# Altium project BY-IOM-v0.2.PrjPCB
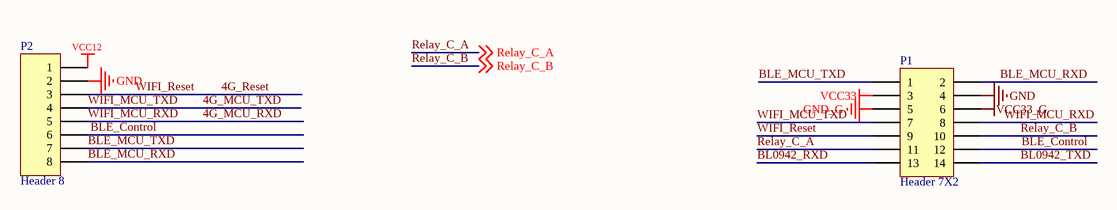
[diagram p0: 连接.SchDoc]
3 sheets, 35 parts. Net scope: global (net labels, ports and power ports of the same name join across sheets).
Board file: Power.PcbDoc
Sheets:
  连接.SchDoc
  继电器.SchDoc
  计量.SchDoc

## Sheet 连接.SchDoc
size A4

### Parts
P1  Header 7X2  [HDR2X7]
P2  Header 8  [HDR1X8]

### Nets
GND: P1.4 P2.2
GND_G: P1.5  [project net Lin]
VCC12: P2.1
VCC33: P1.3
VCC33_G: P1.6
4G_MCU_RXD: P1.8 P2.5  [also labelled WIFI_MCU_RXD]
4G_MCU_TXD: P1.7 P2.4  [also labelled WIFI_MCU_TXD]
4G_Reset: P1.9 P2.3  [also labelled WIFI_Reset]
BL0942_RXD: P1.13
BL0942_TXD: P1.14
BLE_Control: P1.12 P2.6
BLE_MCU_RXD: P1.2 P2.8
BLE_MCU_TXD: P1.1 P2.7
Relay_C_A: P1.11 ; off-sheet Relay_C_A
Relay_C_B: P1.10 ; off-sheet Relay_C_B

### Library data of the parts
P1 = Header 7X2: Header, 7-Pin, Dual row; LatestRevisionDate: 17-Jul-2002; LatestRevisionNote: Re-released for DXP Platform.; Publisher: Altium Limited
P2 = Header 8: Header, 8-Pin; LatestRevisionDate: 17-Jul-2002; LatestRevisionNote: Re-released for DXP Platform.; Publisher: Altium Limited

## Sheet 继电器.SchDoc
size A4
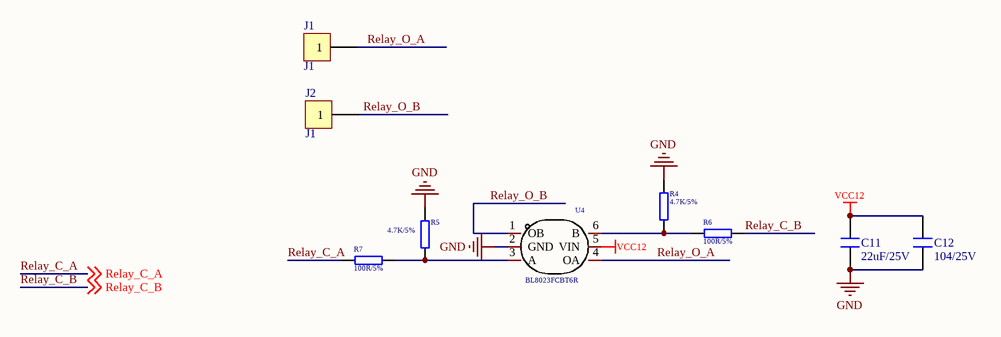
[diagram p1: 继电器.SchDoc]

### Parts
C11  22uF/25V  [0603R]
C12  104/25V  [0603R]
J1  J1  [贴片焊盘V1（3*2椭圆）]
J2  J1  [贴片焊盘V1（3*2椭圆）]
R4  4.7K/5%  [0603R]
R5  4.7K/5%  [0603R]
R6  100R/5%  [0603R]
R7  100R/5%  [0603R]
U4  BL8023FCBT6R  [SOT-23-6]

### Nets
GND: C11.1 C12.1 R4.1 R5.1 U4.2(GND)
VCC12: C11.2 C12.2 U4.5(VIN)
Relay_C_A: R7.2 ; off-sheet Relay_C_A
Relay_C_B: R6.1 ; off-sheet Relay_C_B
Relay_O_A: J1.1 U4.4(OA)
Relay_O_B: J2.1 U4.1(OB)
NetR4_2: R4.2 R6.2 U4.6(B)
NetR5_2: R5.2 R7.1 U4.3(A)

### Library data of the parts
C11 C12 = CAP_1
R4-R7 = RES
U4 = BL8023HCB6TR: Manufacturer: BL(上海贝岭); Add into BOM: yes; Symbol: BL8023HCB6TR; Device: BL8023HCB6TR; Supplier: LCSC; Supplier Part: C431145; Manufacturer Part: BL8023HCB6TR; JLCPCB Part Class: Extended Part; LCSC Part Name: BL8023HCB6TR 继电器驱动芯片 停产; Supplier Footprint: SOT-23-6; Datasheet: https://atta.szlcsc.com/upload/public/pdf/source/20190920/C431145_DEC39E836DB2A2F1462A8BB350F12ABB.pdf; Convert to PCB: yes

## Sheet 计量.SchDoc
size A4
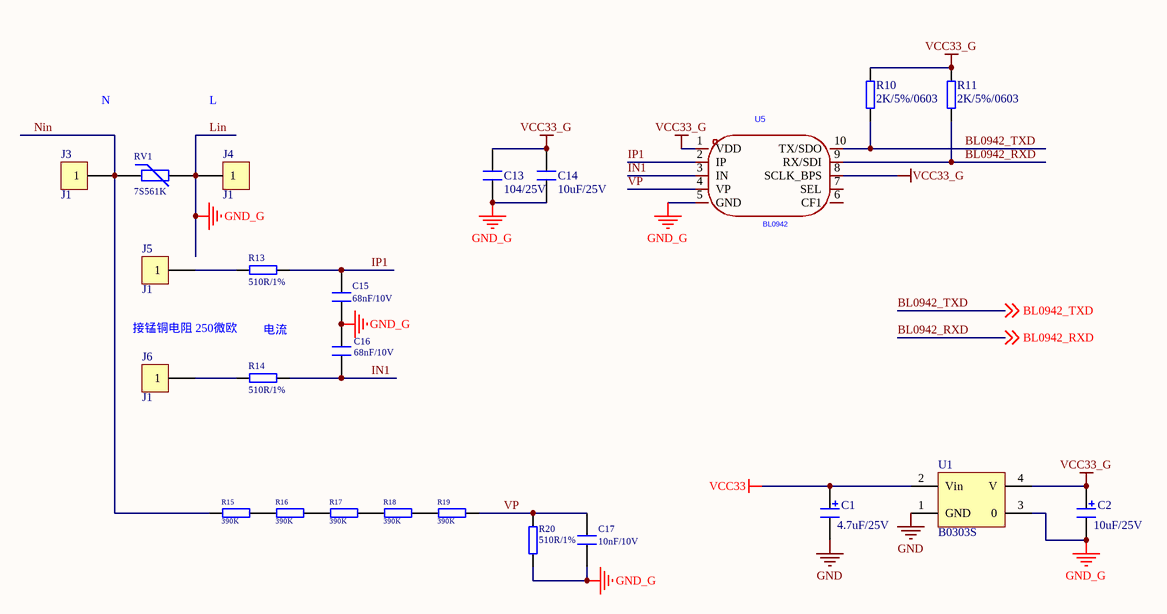
[diagram p2: 计量.SchDoc]

### Parts
C1  4.7uF/25V  [0805R]
C2  10uF/25V  [0805R]
C13  104/25V  [0603R]
C14  10uF/25V  [0603R]
C15  68nF/10V  [0603R]
C16  68nF/10V  [0603R]
C17  10nF/10V  [0603R]
J3  J1  [贴片焊盘V1（3*2椭圆）]
J4  J1  [贴片焊盘V1（3*2椭圆）]
J5  J1  [贴片焊盘V1（3*2椭圆）]
J6  J1  [贴片焊盘V1（3*2椭圆）]
R10  2K/5%/0603  [0603R]
R11  2K/5%/0603  [0603R]
R13  510R/1%  [0603R]
R14  510R/1%  [0603R]
R15  390K  [0805R]
R16  390K  [0805R]
R17  390K  [0805R]
R18  390K  [0805R]
R19  390K  [0805R]
R20  510R/1%  [0603R]
RV1  7S561K  [10D821K]
U1  B0303S  [B1205S-1WR3]
U5  BL0942  [BL0942-10pin]

### Nets
GND: C1.2 U1.1(GND)
Lin: C2.2 C13.1 C14.1 C15.2 C16.2 C17.2 J4.1 R20.1 RV1.2 U1.3(0) U5.5(GND)  [also labelled GND_G]
VCC33: C1.1 U1.2(Vin)
VCC33_G: C2.1 C13.2 C14.2 R10.2 R11.2 U1.4(V) U5.1(VDD) U5.8(SCLK_BPS)
BL0942_RXD: R11.1 U5.9(RX/SDI) ; off-sheet BL0942_RXD
BL0942_TXD: R10.1 U5.10(TX/SDO) ; off-sheet BL0942_TXD
IN1: C16.1 R14.2 U5.3(IN)
IP1: C15.1 R13.2 U5.2(IP)
Nin: J3.1 R15.2 RV1.1
VP: C17.1 R19.1 R20.2 U5.4(VP)
NetJ5_1: J5.1 R13.1
NetJ6_1: J6.1 R14.1
NetR15_1: R15.1 R16.2
NetR16_1: R16.1 R17.2
NetR17_1: R17.1 R18.2
NetR18_1: R18.1 R19.2

Not connected (* = marked no-connect by the designer): U5 6(CF1) 7(SEL)

### Notes on the sheet
- N
- L
- 接锰铜电阻 250微欧
- 电流

### Library data of the parts
C1 C2 = CAP+
C13 C14 = CAP_1
C15-C17 = CAP
R10 R11 R13-R20 = RES
RV1 = Res Varistor: Varistor (Voltage-Sensitive Resistor); Published: 24-Mar-1999; LatestRevisionDate: 29-May-2009; LatestRevisionNote: IPC-7351 Footprint Added.; PackageVersion: Mar-2003; PackageReference: 6-0805; Publisher: Altium Limited; PackageDescription: Chip Resistor 0805 Case Size; Code_IPC: RESC2012
U1 = B0505S
U5 = BL0942_C2837510: Manufacturer: BL(上海贝岭); Add into BOM: yes; Symbol: BL0942; Device: BL0942_C2837510; LCSC Part Name: BL0942内置时钟免校准计量芯片; Supplier Part: C2837510; Manufacturer Part: BL0942; Supplier Footprint: SSOP-10-150mil; JLCPCB Part Class: Extended Part; Datasheet: https://atta.szlcsc.com/upload/public/pdf/source/20220627/BFAD44701CA6DE9A8853C5A4834B6884.pdf; Supplier: LCSC; Convert to PCB: yes

## Nets that join several sheets
GND: 连接 (P1.4 P2.2), 继电器 (5 pins), 计量 (C1.2 U1.1)
Lin: 连接 (P1.5), 计量 (11 pins)
VCC12: 连接 (P2.1), 继电器 (C11.2 C12.2 U4.5)
VCC33: 连接 (P1.3), 计量 (C1.1 U1.2)
VCC33_G: 连接 (P1.6), 计量 (8 pins)
BL0942_RXD: 连接 (P1.13), 计量 (R11.1 U5.9)
BL0942_TXD: 连接 (P1.14), 计量 (R10.1 U5.10)
Relay_C_A: 连接 (P1.11), 继电器 (R7.2)
Relay_C_B: 连接 (P1.10), 继电器 (R6.1)